# Altium schematic sheet Magnetometer.SchDoc
size A
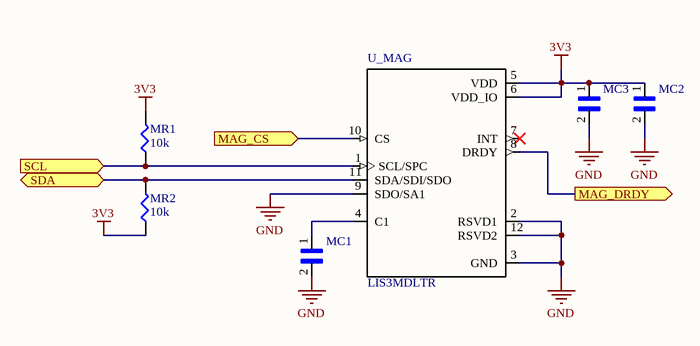
[diagram p0: Magnetometer.SchDoc]

## Parts
MC1  GMK107BJ104KAHT  [*CAPC1608X90N]  (value not drawn)
MC2  TACL105K016XTA  [*CAPC1608X90]  (value not drawn)
MC3  GMK107BJ104KAHT  [*CAPC1608X90N]  (value not drawn)
MR1  10k  [SMD-0603-RES]
MR2  10k  [SMD-0603-RES]
U_MAG  LIS3MDLTR  [*XDCR_LIS3MDLTR]

## Ports
MAG_CS (in), MAG_DRDY (out), SCL (in), SDA (bidir)

## Nets
3V3: MC2.1 MC3.1 MR1.2 MR2.1 U_MAG.5(VDD) U_MAG.6(VDD_IO)
GND: MC1.2 MC2.2 MC3.2 U_MAG.2(RSVD1) U_MAG.3(GND) U_MAG.9(SDO/SA1) U_MAG.12(RSVD2)
MAG_CS: U_MAG.10(CS) ; port MAG_CS
MAG_DRDY: U_MAG.8(DRDY) ; port MAG_DRDY
SCL: MR1.1 U_MAG.1(SCL/SPC) ; port SCL
SDA: MR2.2 U_MAG.11(SDA/SDI/SDO) ; port SDA
NetMC1_1: MC1.1 U_MAG.4(C1)

Not connected (* = marked no-connect by the designer): U_MAG 7(INT)*

## Library data of the parts
MC1 MC3 = GMK107BJ104KAHT: CAP , MLCC , 0603, 35V , X5R, 0.1uF10% , T&R; MF: Taiyo Yuden; Package: 1608 Taiyo Yuden; Digi-Key_Purchase_URL: https://www.digikey.com/product-detail/en/taiyo-yuden/GMK107BJ104KAHT/587-3357-1-ND/4157244?utm_source=snapeda&utm_medium=aggregator&utm_campaign=symbol; Digi-Key_Part_Number: 587-3357-1-ND; SnapEDA_Link: https://www.snapeda.com/parts/GMK107BJ104KAHT/Taiyo%20Yuden/view-part/?ref=snap; MP: GMK107BJ104KAHT; Value: *
MC2 = TACL105K016XTA: Cap Tant Solid 1uF 16V L CASE 10% _1.6 X 0.85 X 0.85mm_ SMD 1608-10 7.5 Ohm 125Â°C Plastic T/R; MF: AVX; Digi-Key_Purchase_URL: https://www.digikey.com/product-detail/en/avx-corporation/TACL105K016XTA/478-4184-1-ND/1212747?utm_source=snapeda&utm_medium=aggregator&utm_campaign=symbol; Digi-Key_Part_Number: 478-4184-1-ND; Package: 0603 AVX; SnapEDA_Link: https://www.snapeda.com/parts/TACL105K016XTA/AVX%20/%20Kyocera/view-part/?ref=snap; MP: TACL105K016XTA; Value: *
MR1 MR2 = ERJ-PA3J103V: RES SMD 10K OHM 5% 1/4W 0603; Manufacturer: Panasonic Electronic Components; Factory Stock: 0; Unit Price (USD): 0.01646; @ qty: 1500; Minimum Quantity: 1; Power (Watts): 0.25W, 1/4W; Temperature Coefficient: ±200ppm/°C; Part Number: ERJ-PA3J103V; Datasheets: https://industrial.panasonic.com/cdbs/www-data/pdf/RDA0000/AOA0000C243.pdf; Image: //media.digikey.com/Photos/Panasonic%20Photos/MFG_ERJ-P6W%20Series.jpg; Digi-Key Part Number: P10KBZCT-ND; Quantity Available: 26345; Packaging: Cut Tape (CT); Series: ERJ; Part Status: Active; Value: 10k; Tolerance: ±5%; Composition: Thick Film; Features: Automotive AEC-Q200, Pulse Withstanding; Operating Temperature: -55°C ~ 155°C; Package / Case: 0603 (1608 Metric); Supplier Device Package: 0603; Size / Dimension: 0.063" L x 0.031" W (1.60mm x 0.80mm); Height - Seated (Max): 0.022" (0.55mm); Number of Terminations: 2; Failure Rate: -
U_MAG = LIS3MDLTR: LIS3MDL Series 3 Axis Â±2/Â±8/Â±12/Â±16 g 3.6V High Performance Magnetometer LGA-12; MF: STMicroelectronics; SnapEDA_Link: https://www.snapeda.com/parts/LIS3MDLTR/STMicroelectronics/view-part/?ref=snap; Digi-Key_Part_Number: 497-13892-1-ND; Digi-Key_Purchase_URL: https://www.digikey.com/product-detail/en/stmicroelectronics/LIS3MDLTR/497-13892-1-ND/4309737?utm_source=snapeda&utm_medium=aggregator&utm_campaign=symbol; Package: VFLGA-12 STMicroelectronics; MP: LIS3MDLTR; Value: *